# Altium project RT1064_V2.PrjPcb
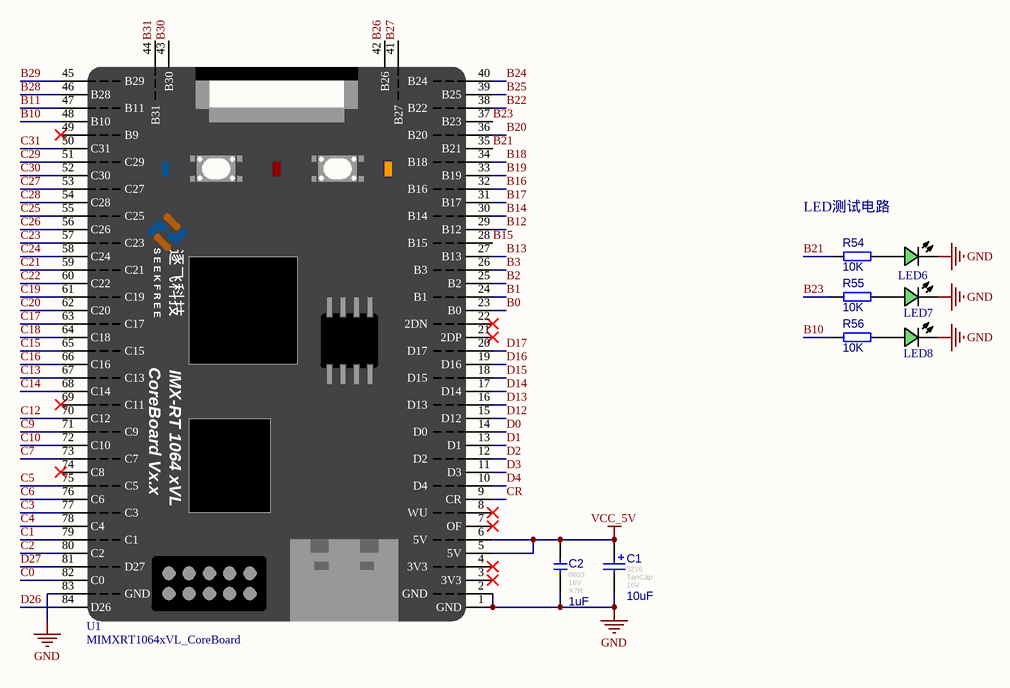
[diagram p0: RT1064_CoreBoard.SchDoc]
4 sheets, 135 parts. Net scope: global (net labels, ports and power ports of the same name join across sheets).
Board file: RT1064_V2PCB.PcbDoc
Sheets:
  RT1064_CoreBoard.SchDoc
  RT1064_Device.SchDoc
  RT1064_Interaction.SchDoc
  RT1064_Power.SchDoc

## Sheet RT1064_CoreBoard.SchDoc
size A4; SheetNumber: 1; SheetTotal: 4

### Parts
C1  value 10uF  FootPrint: 3216  Type: TanCap  Voltage: 16V  [CAP-T-S 3216]  (hidden comment: T-S 10uF 3216 16V)
C2  value 1uF  FootPrint: 0603  Voltage: 16V  Type: X7R  [CAPC1608[0603]S-L]  (hidden comment: 1uF 16V X7R)
LED6  翠绿贴片LED  [LEDC1608(0603)-L]  (value not drawn)
LED7  翠绿贴片LED  [LEDC1608(0603)-L]  (value not drawn)
LED8  翠绿贴片LED  [LEDC1608(0603)-L]  (value not drawn)
R54  value 10K  [RESC1608[0603]S-L]  (hidden comment: 10K ±1%)
R55  value 10K  [RESC1608[0603]S-L]  (hidden comment: 10K ±1%)
R56  value 10K  [RESC1608[0603]S-L]  (hidden comment: 10K ±1%)
U1  MIMXRT1064xVL_CoreBoard  [MIMXRT1064xVL_CoreBoard - 3D]

### Nets
GND: C1.2 C2.1 LED6.C LED7.C LED8.C U1.1(GND) U1.2(GND) U1.83(GND)
VCC_5V: C1.1 C2.2 U1.5(5V) U1.6(5V)
B0: U1.23(B0)
B1: U1.24(B1)
B2: U1.25(B2)
B3: U1.26(B3)
B10: R56.2 U1.48(B10)
B11: U1.47(B11)
B12: U1.29(B12)
B13: U1.27(B13)
B14: U1.30(B14)
B15: U1.28(B15)
B16: U1.32(B16)
B17: U1.31(B17)
B18: U1.34(B18)
B19: U1.33(B19)
B20: U1.36(B20)
B21: R54.2 U1.35(B21)
B22: U1.38(B22)
B23: R55.2 U1.37(B23)
B24: U1.40(B24)
B25: U1.39(B25)
B26: U1.42(B26)
B27: U1.41(B27)
B28: U1.46(B28)
B29: U1.45(B29)
B30: U1.43(B30)
B31: U1.44(B31)
C0: U1.82(C0)
C1: U1.79(C1)
C2: U1.80(C2)
C3: U1.77(C3)
C4: U1.78(C4)
C5: U1.75(C5)
C6: U1.76(C6)
C7: U1.73(C7)
C9: U1.71(C9)
C10: U1.72(C10)
C12: U1.70(C12)
C13: U1.67(C13)
C14: U1.68(C14)
C15: U1.65(C15)
C16: U1.66(C16)
C17: U1.63(C17)
C18: U1.64(C18)
C19: U1.61(C19)
C20: U1.62(C20)
C21: U1.59(C21)
C22: U1.60(C22)
C23: U1.57(C23)
C24: U1.58(C24)
C25: U1.55(C25)
C26: U1.56(C26)
C27: U1.53(C27)
C28: U1.54(C28)
C29: U1.51(C29)
C30: U1.52(C30)
C31: U1.50(C31)
CR: U1.9(CR)
D0: U1.14(D0)
D1: U1.13(D1)
D2: U1.12(D2)
D3: U1.11(D3)
D4: U1.10(D4)
D12: U1.15(D12)
D13: U1.16(D13)
D14: U1.17(D14)
D15: U1.18(D15)
D16: U1.19(D16)
D17: U1.20(D17)
D26: U1.84(D26)
D27: U1.81(D27)
NetLED6_A: LED6.A R54.1
NetLED7_A: LED7.A R55.1
NetLED8_A: LED8.A R56.1

Not connected (* = marked no-connect by the designer): U1 3(3V3)* 4(3V3)* 7(OF)* 8(WU)* 21(2DP)* 22(2DN)* 49(B9)* 69(C11)* 74(C8)*

### Notes on the sheet
- LED测试电路
- (in symbol MIMXRT1064xVL_CoreBoard) S E E K F R E E; 逐飞科技; CoreBoard Vx.x; IMX-RT 1064 xVL

### Library data of the parts
C1 = T-S 10uF 3216 16V: 贴片钽电容 10uF 3216 16V; Revision: July-2002: Re-released for DXP Platform.
C2 = 1uF 0603 16V X7R: 贴片瓷片电容; MLCC; 0603(1608);; Revision: V1.0
LED6-LED8 = LED Chip Green: Published: 8-Jun-2000; Revision: July-2002: Re-released for DXP Platform.; Publisher: Altium Limited; Price(RMB): 0.00
R54-R56 = Res-Chip: 贴片电阻; Power: 1/8W; Revision: V1.0; Tolerance: ±1%
U1 = MIMXRT1064xVL_CoreBoard: 逐飞科技i.MX RT1064核心板整体原理，可直接使用

## Sheet RT1064_Device.SchDoc
size A4; SheetNumber: 2; SheetTotal: 4
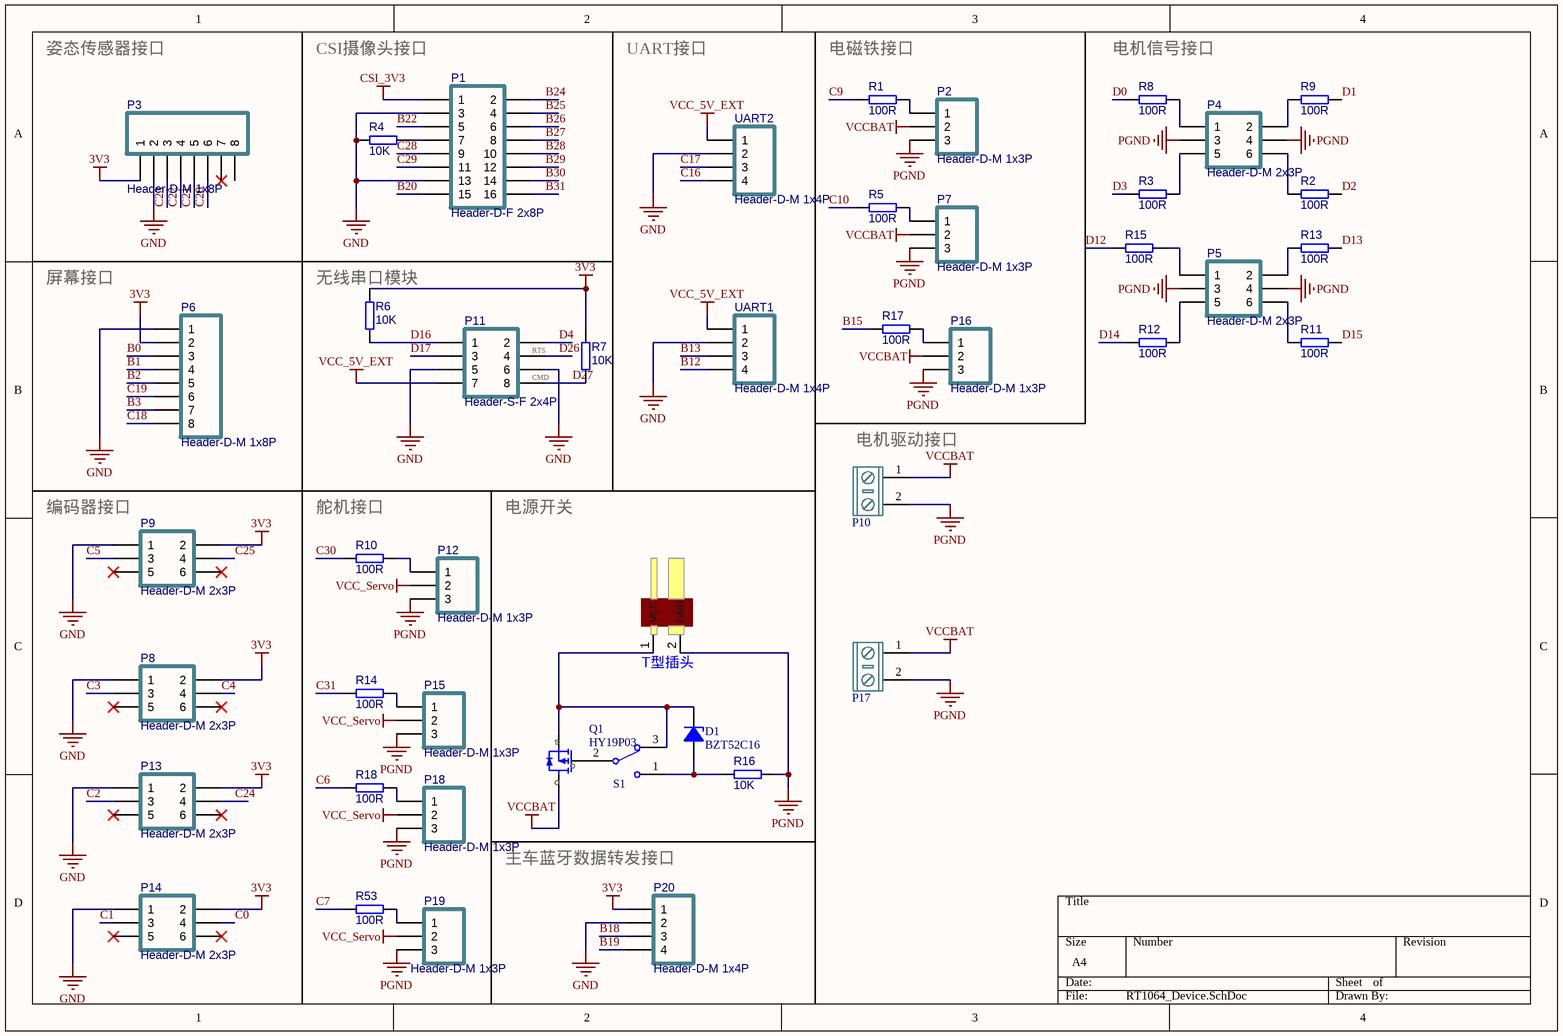
[diagram p1: RT1064_Device.SchDoc]

### Parts
D1  BZT52C16  [SOD-123-L]
DCIN1  T型插头  [CONN-TH_AM-1015B-F]
P1  Header-D-F 2x8P  [Cam_HDR2X8-F-SMT]
P2  Header-D-M 1x3P  [HDR1X3-M]
P3  Header-D-M 1x8P  [Fe-HDR1X8/2.54-S]
P4  Header-D-M 2x3P  [HDR2.54-M-LS-2x3P]
P5  Header-D-M 2x3P  [HDR2.54-M-LS-2x3P]
P6  Header-D-M 1x8P  [Fe-HDR1X8/2.54-S]
P7  Header-D-M 1x3P  [HDR1X3-M]
P8  Header-D-M 2x3P  [DC3-6P-2.54mm]
P9  Header-D-M 2x3P  [DC3-6P-2.54mm]
P10  KF/WJ/DG 30x connecter  [KF/WJ/DG 301-2p-5.0mm]  (value not drawn)
P11  Header-S-F 2x4P  [HDR2X4-F-SMT]
P12  Header-D-M 1x3P  [Fe-HDR1X3/2.54-S]
P13  Header-D-M 2x3P  [DC3-6P-2.54mm]
P14  Header-D-M 2x3P  [DC3-6P-2.54mm]
P15  Header-D-M 1x3P  [Fe-HDR1X3/2.54-S]
P16  Header-D-M 1x3P  [HDR1X3-M]
P17  KF/WJ/DG 30x connecter  [KF/WJ/DG 301-2p-5.0mm]  (value not drawn)
P18  Header-D-M 1x3P  [Fe-HDR1X3/2.54-S]
P19  Header-D-M 1x3P  [Fe-HDR1X3/2.54-S]
P20  Header-D-M 1x4P  [HDR1X4-M]
Q1  HY19P03  [TO-252AA]
R1  value 100R  [RESC1608[0603]S-L]  (hidden comment: 100R ±1%)
R2  value 100R  [RESC1608[0603]S-L]  (hidden comment: 100R ±1%)
R3  value 100R  [RESC1608[0603]S-L]  (hidden comment: 100R ±1%)
R4  value 10K  [RESC1608[0603]S-L]  (hidden comment: 10K ±1%)
R5  value 100R  [RESC1608[0603]S-L]  (hidden comment: 100R ±1%)
R6  value 10K  [RESC1608[0603]S-L]  (hidden comment: 10K ±1%)
R7  value 10K  [RESC1608[0603]S-L]  (hidden comment: 10K ±1%)
R8  value 100R  [RESC1608[0603]S-L]  (hidden comment: 100R ±1%)
R9  value 100R  [RESC1608[0603]S-L]  (hidden comment: 100R ±1%)
R10  value 100R  [RESC1608[0603]S-L]  (hidden comment: 100R ±1%)
R11  value 100R  [RESC1608[0603]S-L]  (hidden comment: 100R ±1%)
R12  value 100R  [RESC1608[0603]S-L]  (hidden comment: 100R ±1%)
R13  value 100R  [RESC1608[0603]S-L]  (hidden comment: 100R ±1%)
R14  value 100R  [RESC1608[0603]S-L]  (hidden comment: 100R ±1%)
R15  value 100R  [RESC1608[0603]S-L]  (hidden comment: 100R ±1%)
R16  value 10K  [RESC1608[0603]S-L]  (hidden comment: 10K ±1%)
R17  value 100R  [RESC1608[0603]S-L]  (hidden comment: 100R ±1%)
R18  value 100R  [RESC1608[0603]S-L]  (hidden comment: 100R ±1%)
R53  value 100R  [RESC1608[0603]S-L]  (hidden comment: 100R ±1%)
S1  SW-SPDT  [SS-12F23]  (value not drawn)
UART1  Header-D-M 1x4P  [XH2.54-WI-4P]
UART2  Header-D-M 1x4P  [XH2.54-WI-4P]

### Nets
3V3: P3.1 P6.2 P8.2 P9.2 P13.2 P14.2 P20.1 R6.2 R7.2
CSI_3V3: P1.1
GND: P1.3 P1.13 P3.2 P6.1 P8.1 P9.1 P11.5 P11.6 P13.1 P14.1 P20.2 R4.2 UART1.2 UART2.2
PGND: DCIN1.2(GND) P2.3 P4.3 P4.4 P5.3 P5.4 P7.3 P10.2 P12.3 P15.3 P16.3 P17.2 P18.3 P19.3 R16.1
VCC_5V_EXT: P11.7 UART1.1 UART2.1
VCC_Servo: P12.2 P15.2 P18.2 P19.2
VCCBAT: P2.2 P7.2 P10.1 P16.2 P17.1 Q1.1(D)
B0: P6.3
B1: P6.4
B2: P6.5
B3: P6.7
B12: UART1.4
B13: UART1.3
B15: R17.2
B18: P20.3
B19: P20.4
B20: P1.15
B22: P1.5
B24: P1.2
B25: P1.4
B26: P1.6
B27: P1.8
B28: P1.10
B29: P1.12
B30: P1.14
B31: P1.16
C0: P14.4
C1: P14.3
C2: P13.3
C3: P8.3
C4: P8.4
C5: P9.3
C6: R18.2
C7: R53.2
C9: R1.2
C10: R5.2
C16: UART2.4
C17: UART2.3
C18: P6.8
C19: P6.6
C20: P3.6
C21: P3.5
C22: P3.4
C23: P3.3
C24: P13.4
C25: P9.4
C28: P1.9
C29: P1.11
C30: R10.2
C31: R14.2
D0: R8.1
D1: R9.1
D2: R2.1
D3: R3.1
D4: P11.2
D12: R15.1
D13: R13.1
D14: R12.1
D15: R11.1
D16: P11.1 R6.1
D17: P11.3
D26: P11.4
D27: P11.8 R7.1
NetD1_A: D1.A R16.2 S1.1
NetD1_K: D1.K DCIN1.1(VCC) Q1.3(S) S1.3
NetP1_7: P1.7 R4.1
NetP2_1: P2.1 R1.1
NetP4_1: P4.1 R8.2
NetP4_2: P4.2 R9.2
NetP4_5: P4.5 R3.2
NetP4_6: P4.6 R2.2
NetP5_1: P5.1 R15.2
NetP5_2: P5.2 R13.2
NetP5_5: P5.5 R12.2
NetP5_6: P5.6 R11.2
NetP7_1: P7.1 R5.1
NetP12_1: P12.1 R10.1
NetP15_1: P15.1 R14.1
NetP16_1: P16.1 R17.1
NetP18_1: P18.1 R18.1
NetP19_1: P19.1 R53.1
NetQ1_2: Q1.2(G) S1.2

Not connected (* = marked no-connect by the designer): P3 7* 8; P8 5* 6*; P9 5* 6*; P13 5* 6*; P14 5* 6*

### Notes on the sheet
- 姿态传感器接口
- CSI摄像头接口
- UART接口
- (near R1) 电磁铁接口
- (near R8) 电机信号接口
- 屏幕接口
- (near R6) 无线串口模块
- (near P11) RTS
- (near P11) CMD
- (near P10) 电机驱动接口
- 编码器接口
- (near R10) 舵机接口
- 电源开关
- 主车蓝牙数据转发接口

### Library data of the parts
D1 = Diode Zen: 稳压二极管 齐纳二极管  Zener Diode; Published: 8-Jun-2000; Revision: July-2002: Re-released for DXP Platform.; Publisher: Altium Limited; Price(RMB): 0.000
DCIN1 = T_Header
P1 = Header-D-F 2x8P: 2x8pin, 直插, 双排座; Revision: V1.0; Value: Header-D-F 2x8P
P2 P7 P12 P15 P16 P18 P19 = Header-D-M 1x3P: 1x3pin, 直插, 排针; Revision: V1.0; Value: Header-D-M 1x3P
P3 P6 = Header-D-M 1x8P: 1x8pin, 直插, 排针; Revision: V1.0; Value: Header-D-M 1x8P
P4 P5 P8 P9 P13 P14 = Header-S-M 2x3P: 2x3pin, 贴片, 双排针; Revision: V1.0; Value: Header-D-M 2x3P
P10 P17 = KF/WJ/DG 30x: 接线端子 2Pin
P11 = Header-S-F 2x4P: 2x4pin, 贴片, 双排座; Revision: V1.0; Value: Header-S-F 2x4P
P20 UART1 UART2 = Header-D-M 1x4P: 1x4pin, 直插, 排针; Revision: V1.0; Value: Header-D-M 1x4P
Q1 = HY19P03: HY19P03 P-Channel MOSFET
R1-R18 R53 = Res-Chip: 贴片电阻; Power: 1/8W; Revision: V1.0; Tolerance: ±1%
S1 = SW-SPDT: 单刀双掷开关 3脚船型、钮子、拨动开关 SPDT Subminiature Toggle Switch; Published: 24-Mar-1999; Publisher: Altium Limited; Price(RMB): 0.000

## Sheet RT1064_Interaction.SchDoc
size A4; SheetNumber: 3; SheetTotal: 4
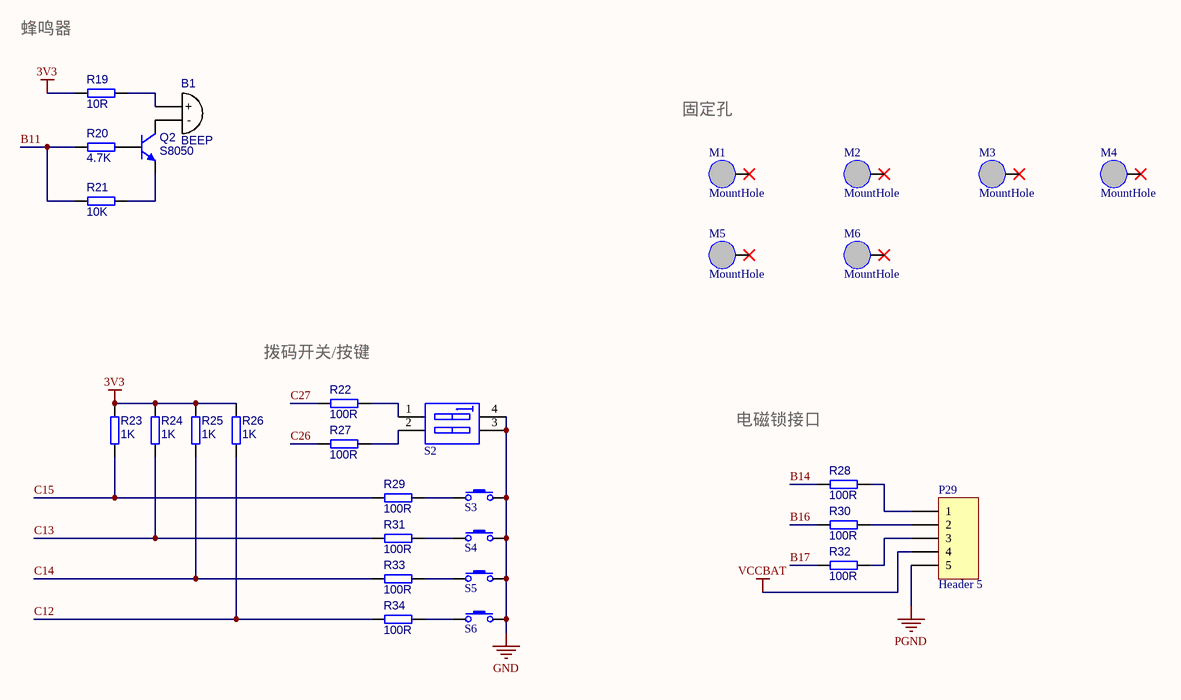
[diagram p2: RT1064_Interaction.SchDoc]

### Parts
B1  BEEP  [BEEP 9x5.5mm]
M1  MountHole  [M3x12+6_N]  (no BOM)
M2  MountHole  [M3x12+6_N]  (no BOM)
M3  MountHole  [M3x12+6_N]  (no BOM)
M4  MountHole  [M3x12+6_N]  (no BOM)
M5  MountHole  [M3-MountHole]  (no BOM)
M6  MountHole  [M3-MountHole]  (no BOM)
P29  Header 5  [HDR1X5]
Q2  S8050  [SOT-23]
R19  value 10R  [RESC1608[0603]S-L]  (hidden comment: 10R ±1%)
R20  value 4.7K  [RESC1608[0603]S-L]  (hidden comment: 4.7K ±1%)
R21  value 10K  [RESC1608[0603]S-L]  (hidden comment: 10K ±1%)
R22  value 100R  [RESC1608[0603]S-L]  (hidden comment: 100R ±1%)
R23  value 1K  [RESC1608[0603]S-L]  (hidden comment: 1K ±1%)
R24  value 1K  [RESC1608[0603]S-L]  (hidden comment: 1K ±1%)
R25  value 1K  [RESC1608[0603]S-L]  (hidden comment: 1K ±1%)
R26  value 1K  [RESC1608[0603]S-L]  (hidden comment: 1K ±1%)
R27  value 100R  [RESC1608[0603]S-L]  (hidden comment: 100R ±1%)
R28  value 100R  [RESC1608[0603]S-L]  (hidden comment: 100R ±1%)
R29  value 100R  [RESC1608[0603]S-L]  (hidden comment: 100R ±1%)
R30  value 100R  [RESC1608[0603]S-L]  (hidden comment: 100R ±1%)
R31  value 100R  [RESC1608[0603]S-L]  (hidden comment: 100R ±1%)
R32  value 100R  [RESC1608[0603]S-L]  (hidden comment: 100R ±1%)
R33  value 100R  [RESC1608[0603]S-L]  (hidden comment: 100R ±1%)
R34  value 100R  [RESC1608[0603]S-L]  (hidden comment: 100R ±1%)
S2  SW DIP-2  [Code SW-2-DIP-2.54]  (value not drawn)
S3  Button  [PTS810-3*4-CurvePin]  (value not drawn)
S4  Button  [PTS810-3*4-CurvePin]  (value not drawn)
S5  Button  [PTS810-3*4-CurvePin]  (value not drawn)
S6  Button  [PTS810-3*4-CurvePin]  (value not drawn)

### Nets
3V3: R19.2 R23.1 R24.1 R25.1 R26.1
GND: S2.3(B2) S2.4(B1) S3.1 S4.1 S5.1 S6.1
PGND: P29.5
VCCBAT: P29.4
B11: R20.2 R21.2
B14: R28.2
B16: R30.2
B17: R32.2
C12: R26.2 R34.2
C13: R24.2 R31.2
C14: R25.2 R33.2
C15: R23.2 R29.2
C26: R27.2
C27: R22.2
NetB1_1: B1.1(+) R19.1
NetB1_2: B1.2(-) Q2.3(C)
NetP29_1: P29.1 R28.1
NetP29_2: P29.2 R30.1
NetP29_3: P29.3 R32.1
NetQ2_1: Q2.1(B) R20.1
NetQ2_2: Q2.2(E) R21.1
NetR22_1: R22.1 S2.1(A1)
NetR27_1: R27.1 S2.2(A2)
NetR29_1: R29.1 S3.2
NetR31_1: R31.1 S4.2
NetR33_1: R33.1 S5.2
NetR34_1: R34.1 S6.2

Not connected (* = marked no-connect by the designer): M1 1*; M2 1*; M3 1*; M4 1*; M5 1*; M6 1*

### Notes on the sheet
- 蜂鸣器
- 固定孔
- 拨码开关/按键
- 电磁锁接口

### Library data of the parts
B1 = BEEP: 蜂鸣器
M1-M6 = MountHole: 固定孔
P29 = Header 5: Header, 5-Pin; LatestRevisionDate: 17-Jul-2002; LatestRevisionNote: Re-released for DXP Platform.; Publisher: Altium Limited
Q2 = NPN S8050: Discrete NPN Bipolar Transistor; Published: 8-Jun-2000; Revision: July-2002: Re-released for DXP Platform.; Publisher: Altium Limited; Price(RMB): 0.000; PartNumber: S8050
R19-R34 = Res-Chip: 贴片电阻; Power: 1/8W; Revision: V1.0; Tolerance: ±1%
S2 = Code SW-2: 2位拨码开关; Published: 24-Mar-1999; Revision: July-2002: Re-released for DXP Platform.; Publisher: Altium Limited; Price(RMB): 0.000
S3-S6 = KEY: 按键; Published: 24-Mar-1999; Publisher: Altium Limited; Price(RMB): 0.000

## Sheet RT1064_Power.SchDoc
size A4; SheetNumber: 4; SheetTotal: 4
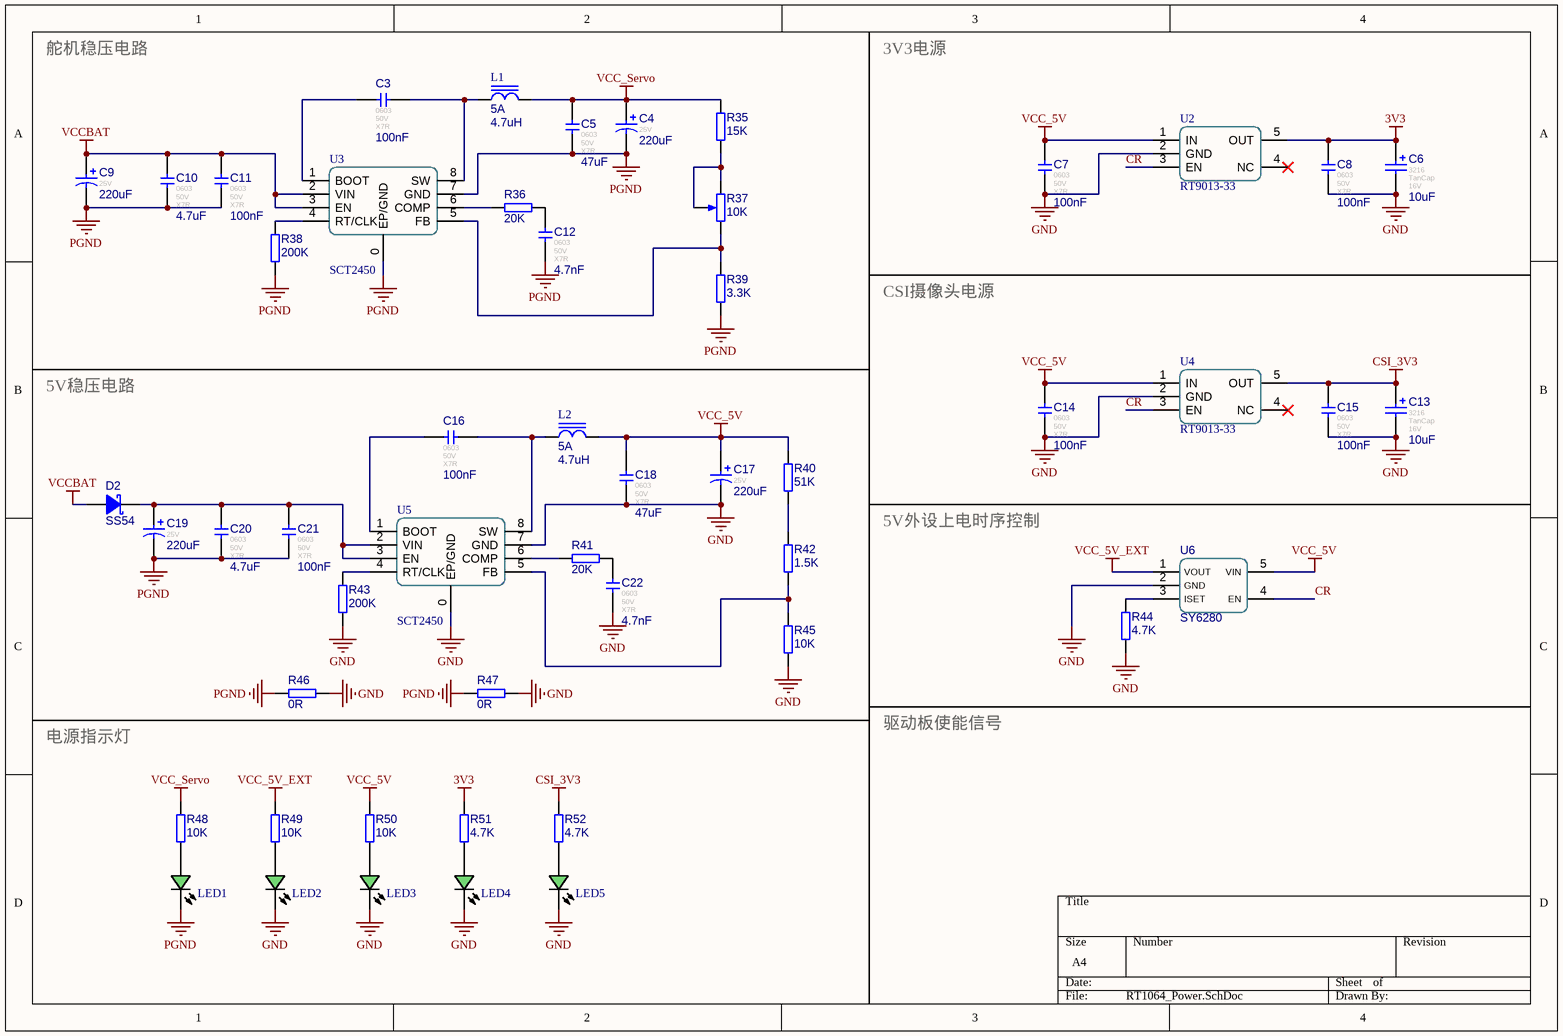
[diagram p3: RT1064_Power.SchDoc]

### Parts
C3  value 100nF  FootPrint: 0603  Voltage: 50V  Type: X7R  [CAPC1608[0603]S-L]  (hidden comment: 100nF 50V X7R)
C4  value 220uF  Voltage: 25V  [CAP-E-S 6.3]  (hidden comment: 220uF 25V 铝电解)
C5  value 47uF  FootPrint: 0603  Voltage: 50V  Type: X7R  [CAPC1608[0603]S-L]  (hidden comment: 47uF 50V X7R)
C6  value 10uF  FootPrint: 3216  Type: TanCap  Voltage: 16V  [CAP-T-S 3216]  (hidden comment: T-S 10uF 3216 16V)
C7  value 100nF  FootPrint: 0603  Voltage: 50V  Type: X7R  [CAPC1608[0603]S-L]  (hidden comment: 100nF 50V X7R)
C8  value 100nF  FootPrint: 0603  Voltage: 50V  Type: X7R  [CAPC1608[0603]S-L]  (hidden comment: 100nF 50V X7R)
C9  value 220uF  Voltage: 25V  [CAP-E-S 6.3]  (hidden comment: 220uF 25V 铝电解)
C10  value 4.7uF  FootPrint: 0603  Voltage: 50V  Type: X7R  [CAPC1608[0603]S-L]  (hidden comment: 4.7uF 50V X7R)
C11  value 100nF  FootPrint: 0603  Voltage: 50V  Type: X7R  [CAPC1608[0603]S-L]  (hidden comment: 100nF 50V X7R)
C12  value 4.7nF  FootPrint: 0603  Voltage: 50V  Type: X7R  [CAPC1608[0603]S-L]  (hidden comment: 4.7nF 50V X7R)
C13  value 10uF  FootPrint: 3216  Type: TanCap  Voltage: 16V  [CAP-T-S 3216]  (hidden comment: T-S 10uF 3216 16V)
C14  value 100nF  FootPrint: 0603  Voltage: 50V  Type: X7R  [CAPC1608[0603]S-L]  (hidden comment: 100nF 50V X7R)
C15  value 100nF  FootPrint: 0603  Voltage: 50V  Type: X7R  [CAPC1608[0603]S-L]  (hidden comment: 100nF 50V X7R)
C16  value 100nF  FootPrint: 0603  Voltage: 50V  Type: X7R  [CAPC1608[0603]S-L]  (hidden comment: 100nF 50V X7R)
C17  value 220uF  Voltage: 25V  [CAP-E-S 6.3]  (hidden comment: 220uF 25V 铝电解)
C18  value 47uF  FootPrint: 0603  Voltage: 50V  Type: X7R  [CAPC1608[0603]S-L]  (hidden comment: 47uF 50V X7R)
C19  value 220uF  Voltage: 25V  [CAP-E-S 6.3]  (hidden comment: 220uF 25V 铝电解)
C20  value 4.7uF  FootPrint: 0603  Voltage: 50V  Type: X7R  [CAPC1608[0603]S-L]  (hidden comment: 4.7uF 50V X7R)
C21  value 100nF  FootPrint: 0603  Voltage: 50V  Type: X7R  [CAPC1608[0603]S-L]  (hidden comment: 100nF 50V X7R)
C22  value 4.7nF  FootPrint: 0603  Voltage: 50V  Type: X7R  [CAPC1608[0603]S-L]  (hidden comment: 4.7nF 50V X7R)
D2  SS54  [SMA-L[DO-214AC]]
L1  value 4.7uH  Imax: 5A  [0630 TPC 7*7*3]  (hidden comment: 4.7uH 5A)
L2  value 4.7uH  Imax: 5A  [0630 TPC 7*7*3]  (hidden comment: 4.7uH 5A)
LED1  翠绿贴片LED  [LEDC1608(0603)-L]  (value not drawn)
LED2  翠绿贴片LED  [LEDC1608(0603)-L]  (value not drawn)
LED3  翠绿贴片LED  [LEDC1608(0603)-L]  (value not drawn)
LED4  翠绿贴片LED  [LEDC1608(0603)-L]  (value not drawn)
LED5  翠绿贴片LED  [LEDC1608(0603)-L]  (value not drawn)
R35  value 15K  [RESC1608[0603]S-L]  (hidden comment: 15K ±1%)
R36  value 20K  [RESC1608[0603]S-L]  (hidden comment: 20K ±1%)
R37  10K  [RESPOT3296W]
R38  value 200K  [RESC1608[0603]S-L]  (hidden comment: 200K ±1%)
R39  value 3.3K  [RESC1608[0603]S-L]  (hidden comment: 3.3K ±1%)
R40  value 51K  [RESC1608[0603]S-L]  (hidden comment: 51K ±1%)
R41  value 20K  [RESC1608[0603]S-L]  (hidden comment: 20K ±1%)
R42  value 1.5K  [RESC1608[0603]S-L]  (hidden comment: 1.5K ±1%)
R43  value 200K  [RESC1608[0603]S-L]  (hidden comment: 200K ±1%)
R44  value 4.7K  [RESC1608[0603]S-L]  (hidden comment: 4.7K ±1%)
R45  value 10K  [RESC1608[0603]S-L]  (hidden comment: 10K ±1%)
R46  value 0R  [RESC1608[0603]S-L]  (hidden comment: 0R ±1%)
R47  value 0R  [RESC1608[0603]S-L]  (hidden comment: 0R ±1%)
R48  value 10K  [RESC1608[0603]S-L]  (hidden comment: 10K ±1%)
R49  value 10K  [RESC1608[0603]S-L]  (hidden comment: 10K ±1%)
R50  value 10K  [RESC1608[0603]S-L]  (hidden comment: 10K ±1%)
R51  value 4.7K  [RESC1608[0603]S-L]  (hidden comment: 4.7K ±1%)
R52  value 4.7K  [RESC1608[0603]S-L]  (hidden comment: 4.7K ±1%)
U2  RT9013-33  [SOT-23-5]
U3  SCT2450  [SOP-8E]
U4  RT9013-33  [SOT-23-5]
U5  SCT2450  [SOP-8E]
U6  SY6280  [SOT-23-5]

### Nets
3V3: C6.1 C8.2 R51.2 U2.5(OUT)
CSI_3V3: C13.1 C15.2 R52.2 U4.5(OUT)
GND: C6.2 C7.1 C8.1 C13.2 C14.1 C15.1 C17.2 C18.1 C22.1 LED2.C LED3.C LED4.C LED5.C R43.1 R44.1 R45.1 R46.2 R47.2 U2.2(GND) U4.2(GND) U5.0(EP/GND) U5.7(GND) U6.2(GND)
PGND: C4.2 C5.1 C9.2 C10.1 C11.1 C12.1 C19.2 C20.1 C21.1 LED1.C R38.1 R39.1 R46.1 R47.1 U3.0(EP/GND) U3.7(GND)
VCC_5V: C7.2 C14.2 C17.1 C18.2 L2.2 R40.2 R50.2 U2.1(IN) U4.1(IN) U6.5(VIN)
VCC_5V_EXT: R49.2 U6.1(VOUT)
VCC_Servo: C4.1 C5.2 L1.2 R35.2 R48.2
VCCBAT: C9.1 C10.2 C11.2 D2.A U3.2(VIN) U3.3(EN)
CR: U2.3(EN) U4.3(EN) U6.4(EN)
NetC3_1: C3.1 L1.1 U3.8(SW)
NetC3_2: C3.2 U3.1(BOOT)
NetC12_2: C12.2 R36.1
NetC16_1: C16.1 L2.1 U5.8(SW)
NetC16_2: C16.2 U5.1(BOOT)
NetC19_1: C19.1 C20.2 C21.2 D2.K U5.2(VIN) U5.3(EN)
NetC22_2: C22.2 R41.1
NetLED1_A: LED1.A R48.1
NetLED2_A: LED2.A R49.1
NetLED3_A: LED3.A R50.1
NetLED4_A: LED4.A R51.1
NetLED5_A: LED5.A R52.1
NetR35_1: R35.1 R37.1(TOP) R37.ADJ
NetR36_2: R36.2 U3.6(COMP)
NetR37_2: R37.2(BOT) R39.2 U3.5(FB)
NetR38_2: R38.2 U3.4(RT/CLK)
NetR40_1: R40.1 R42.2
NetR41_2: R41.2 U5.6(COMP)
NetR42_1: R42.1 R45.2 U5.5(FB)
NetR43_2: R43.2 U5.4(RT/CLK)
NetR44_2: R44.2 U6.3(ISET)

Not connected (* = marked no-connect by the designer): U2 4(NC)*; U4 4(NC)*

### Notes on the sheet
- 舵机稳压电路
- 3V3电源
- CSI摄像头电源
- 5V稳压电路
- 5V外设上电时序控制
- 电源指示灯
- 驱动板使能信号

### Library data of the parts
C3 C5 C7 C8 C10 C11 C14-C16 C18 C20 C21 = 100nF 0603 50V X7R: 贴片瓷片电容; MLCC; 0603(1608);; Revision: V1.0
C4 C9 C17 C19 = E-S 220uF 25V 6.3x7.7: 贴片电解电容 220uF 25V 6.3x7.7; Revision: V1.0; Type: 铝电解
C6 C13 = T-S 10uF 3216 16V: 贴片钽电容 10uF 3216 16V; Revision: July-2002: Re-released for DXP Platform.
C12 C22 = 4.7nF 0603 50V X7R: 贴片瓷片电容; MLCC; 0603(1608);; Revision: V1.0
D2 = SS54: SS54 肖特基二极管; Revision: V1.0; Value: SS54
L1 L2 = Ind-Power: 功率电感; DCR: .5m; Published: 8-Jun-2000; Revision: July-2002: Re-released for DXP Platform.; Publisher: Altium Limited; Price(RMB): 0.000
LED1-LED5 = LED Chip Green: Published: 8-Jun-2000; Revision: July-2002: Re-released for DXP Platform.; Publisher: Altium Limited; Price(RMB): 0.00
R35 R36 R38-R45 R48-R52 = Res-Chip: 贴片电阻; Power: 1/8W; Revision: V1.0; Tolerance: ±1%
R37 = Res-Adj-3p: 可调电阻; Value: 10K
R46 R47 = Res-Chip_1: 贴片电阻; Power: 1/8W; Revision: V1.0; Tolerance: ±1%
U2 U4 = RT9013-33: 3.3V 500mA SOT-23-5 LDO
U3 U5 = SCT2450: 3.8V-36V Vin, 5A, High Efficiency Synchronous Step-down DCDC Converter / with Programmable Frequency
U6 = SY6280: SY6280 2A 限额配电开关; Imax: 2.1A; Published: 2020-12-08; Revision: V1.0

## Nets that join several sheets
3V3: RT1064_Device (9 pins), RT1064_Interaction (5 pins), RT1064_Power (C6.1 C8.2 R51.2 U2.5)
CSI_3V3: RT1064_Device (P1.1), RT1064_Power (C13.1 C15.2 R52.2 U4.5)
GND: RT1064_CoreBoard (8 pins), RT1064_Device (14 pins), RT1064_Interaction (6 pins), RT1064_Power (23 pins)
PGND: RT1064_Device (15 pins), RT1064_Interaction (P29.5), RT1064_Power (16 pins)
VCC_5V: RT1064_CoreBoard (C1.1 C2.2 U1.5 U1.6), RT1064_Power (10 pins)
VCC_5V_EXT: RT1064_Device (P11.7 UART1.1 UART2.1), RT1064_Power (R49.2 U6.1)
VCC_Servo: RT1064_Device (P12.2 P15.2 P18.2 P19.2), RT1064_Power (5 pins)
VCCBAT: RT1064_Device (6 pins), RT1064_Interaction (P29.4), RT1064_Power (6 pins)
B0: RT1064_CoreBoard (U1.23), RT1064_Device (P6.3)
B1: RT1064_CoreBoard (U1.24), RT1064_Device (P6.4)
B2: RT1064_CoreBoard (U1.25), RT1064_Device (P6.5)
B3: RT1064_CoreBoard (U1.26), RT1064_Device (P6.7)
B11: RT1064_CoreBoard (U1.47), RT1064_Interaction (R20.2 R21.2)
B12: RT1064_CoreBoard (U1.29), RT1064_Device (UART1.4)
B13: RT1064_CoreBoard (U1.27), RT1064_Device (UART1.3)
B14: RT1064_CoreBoard (U1.30), RT1064_Interaction (R28.2)
B15: RT1064_CoreBoard (U1.28), RT1064_Device (R17.2)
B16: RT1064_CoreBoard (U1.32), RT1064_Interaction (R30.2)
B17: RT1064_CoreBoard (U1.31), RT1064_Interaction (R32.2)
B18: RT1064_CoreBoard (U1.34), RT1064_Device (P20.3)
B19: RT1064_CoreBoard (U1.33), RT1064_Device (P20.4)
B20: RT1064_CoreBoard (U1.36), RT1064_Device (P1.15)
B22: RT1064_CoreBoard (U1.38), RT1064_Device (P1.5)
B24: RT1064_CoreBoard (U1.40), RT1064_Device (P1.2)
B25: RT1064_CoreBoard (U1.39), RT1064_Device (P1.4)
B26: RT1064_CoreBoard (U1.42), RT1064_Device (P1.6)
B27: RT1064_CoreBoard (U1.41), RT1064_Device (P1.8)
B28: RT1064_CoreBoard (U1.46), RT1064_Device (P1.10)
B29: RT1064_CoreBoard (U1.45), RT1064_Device (P1.12)
B30: RT1064_CoreBoard (U1.43), RT1064_Device (P1.14)
B31: RT1064_CoreBoard (U1.44), RT1064_Device (P1.16)
C0: RT1064_CoreBoard (U1.82), RT1064_Device (P14.4)
C1: RT1064_CoreBoard (U1.79), RT1064_Device (P14.3)
C2: RT1064_CoreBoard (U1.80), RT1064_Device (P13.3)
C3: RT1064_CoreBoard (U1.77), RT1064_Device (P8.3)
C4: RT1064_CoreBoard (U1.78), RT1064_Device (P8.4)
C5: RT1064_CoreBoard (U1.75), RT1064_Device (P9.3)
C6: RT1064_CoreBoard (U1.76), RT1064_Device (R18.2)
C7: RT1064_CoreBoard (U1.73), RT1064_Device (R53.2)
C9: RT1064_CoreBoard (U1.71), RT1064_Device (R1.2)
C10: RT1064_CoreBoard (U1.72), RT1064_Device (R5.2)
C12: RT1064_CoreBoard (U1.70), RT1064_Interaction (R26.2 R34.2)
C13: RT1064_CoreBoard (U1.67), RT1064_Interaction (R24.2 R31.2)
C14: RT1064_CoreBoard (U1.68), RT1064_Interaction (R25.2 R33.2)
C15: RT1064_CoreBoard (U1.65), RT1064_Interaction (R23.2 R29.2)
C16: RT1064_CoreBoard (U1.66), RT1064_Device (UART2.4)
C17: RT1064_CoreBoard (U1.63), RT1064_Device (UART2.3)
C18: RT1064_CoreBoard (U1.64), RT1064_Device (P6.8)
C19: RT1064_CoreBoard (U1.61), RT1064_Device (P6.6)
C20: RT1064_CoreBoard (U1.62), RT1064_Device (P3.6)
C21: RT1064_CoreBoard (U1.59), RT1064_Device (P3.5)
C22: RT1064_CoreBoard (U1.60), RT1064_Device (P3.4)
C23: RT1064_CoreBoard (U1.57), RT1064_Device (P3.3)
C24: RT1064_CoreBoard (U1.58), RT1064_Device (P13.4)
C25: RT1064_CoreBoard (U1.55), RT1064_Device (P9.4)
C26: RT1064_CoreBoard (U1.56), RT1064_Interaction (R27.2)
C27: RT1064_CoreBoard (U1.53), RT1064_Interaction (R22.2)
C28: RT1064_CoreBoard (U1.54), RT1064_Device (P1.9)
C29: RT1064_CoreBoard (U1.51), RT1064_Device (P1.11)
C30: RT1064_CoreBoard (U1.52), RT1064_Device (R10.2)
C31: RT1064_CoreBoard (U1.50), RT1064_Device (R14.2)
CR: RT1064_CoreBoard (U1.9), RT1064_Power (U2.3 U4.3 U6.4)
D0: RT1064_CoreBoard (U1.14), RT1064_Device (R8.1)
D1: RT1064_CoreBoard (U1.13), RT1064_Device (R9.1)
D2: RT1064_CoreBoard (U1.12), RT1064_Device (R2.1)
D3: RT1064_CoreBoard (U1.11), RT1064_Device (R3.1)
D4: RT1064_CoreBoard (U1.10), RT1064_Device (P11.2)
D12: RT1064_CoreBoard (U1.15), RT1064_Device (R15.1)
D13: RT1064_CoreBoard (U1.16), RT1064_Device (R13.1)
D14: RT1064_CoreBoard (U1.17), RT1064_Device (R12.1)
D15: RT1064_CoreBoard (U1.18), RT1064_Device (R11.1)
D16: RT1064_CoreBoard (U1.19), RT1064_Device (P11.1 R6.1)
D17: RT1064_CoreBoard (U1.20), RT1064_Device (P11.3)
D26: RT1064_CoreBoard (U1.84), RT1064_Device (P11.4)
D27: RT1064_CoreBoard (U1.81), RT1064_Device (P11.8 R7.1)